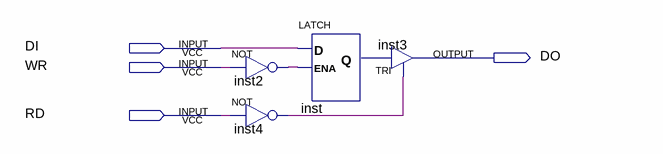
[diagram p0: schematic sheet]
// Quartus schematic MU_1Bit.bdf as structural Verilog: 4 symbols, 4 pins
module MU_1Bit (
  input  DI,
  input  WR,
  input  RD,
  output DO
);

  wire inst2_out, inst4_out, inst_q;

  not inst2 (inst2_out, WR);
  not inst4 (inst4_out, RD);
  LATCH inst (.D(DI), .ENA(inst2_out), .Q(inst_q));
  TRI inst3 (.IN(inst_q), .OE(inst4_out), .OUT(DO));
endmodule
